# EAGLE design through hole mk1 (EAGLE 6.2)
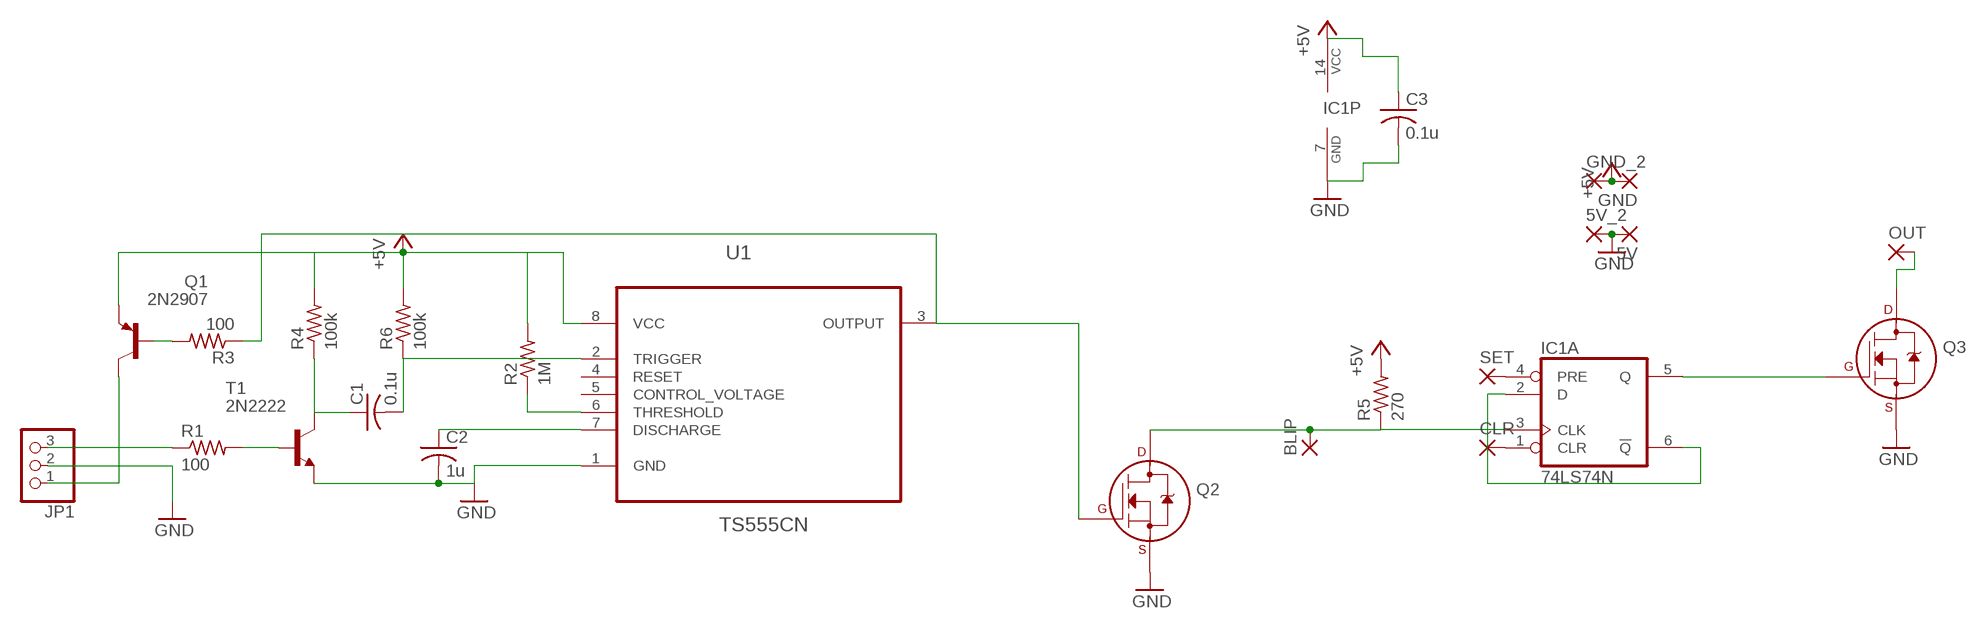
[diagram p0: schematic, sheet 1]

## Parts
5V  1,6/0,8  [1,6/0,8]
5V_2  1,6/0,8  [1,6/0,8]
BLIP  1,6/0,8  [1,6/0,8]
C1  0.1u  C-US025-030X050  [C025-030X050]
C2  1u  C-US025-030X050  [C025-030X050]
C3  0.1u  C-US025-030X050  [C025-030X050]
CLR  1,6/0,8  [1,6/0,8]
GND  1,6/0,8  [1,6/0,8]
GND_2  1,6/0,8  [1,6/0,8]
IC1  74LS74N  [DIL14]
JP1  PINHD-1X3  [1X03]
OUT  1,6/0,8  [1,6/0,8]
Q1  2N2907  [TO92-EBC-OVAL]
Q2  2N7000_TO92  [TO-92]
Q3  2N7000_TO92  [TO-92]
R1  100  R-US_0204/5  [0204/5]
R2  1M  R-US_0204/5  [0204/5]
R3  100  R-US_0204/5  [0204/5]
R4  100k  R-US_0204/5  [0204/5]
R5  270  R-US_0204/5  [0204/5]
R6  100k  R-US_0204/5  [0204/5]
SET  1,6/0,8  [1,6/0,8]
T1  2N2222  [TO92-EBC-OVAL]
U1  TS555CN  [DIP254P762X533-8]

## Nets
+5V: C3.1 GND.1(P) GND_2.1(P) IC1.14(P:VCC) Q1.E R2.2 R4.2 R5.2 R6.2 U1.8(VCC)
GND: 5V.1(P) 5V_2.1(P) C2.2 C3.2 IC1.7(P:GND) JP1.2 Q2.1(S) Q3.1(S) T1.E U1.1(GND)
N$1: Q1.B R3.2
N$2: JP1.1 Q1.C
N$3: R1.2 T1.B
N$4: JP1.3 R1.1
N$5: IC1.4(A:PRE) SET.1(P)
N$6: C1.1 R4.1 T1.C
N$7: C1.2 R6.1 U1.2(TRIGGER)
N$8: CLR.1(P) IC1.1(A:CLR)
N$9: R2.1 U1.6(THRESHOLD)
N$10: Q2.2(G) R3.1 U1.3(OUTPUT)
N$11: BLIP.1(P) IC1.3(A:CLK) Q2.3(D) R5.1
N$12: IC1.2(A:D) IC1.6(A:!Q)
N$13: IC1.5(A:Q) Q3.2(G)
N$14: C2.1 U1.7(DISCHARGE)
N$15: OUT.1(P) Q3.3(D)
Unconnected: IC1.8(B:!Q) IC1.9(B:Q) IC1.10(B:PRE) IC1.11(B:CLK) IC1.12(B:D) IC1.13(B:CLR) U1.4(RESET) U1.5(CONTROL_VOLTAGE)

## Library data of the parts
5V 5V_2 BLIP CLR GND GND_2 OUT SET = wirepad:1,6/0,8: THROUGH-HOLE PAD
C1-C3 = adafruit:C-US: CAPACITOR, American symbol
IC1 = 74xx-us:74*74: Dual D type positive edge triggered FLIP FLOP, preset and clear
JP1 = adafruit:PINHD-1X3: PIN HEADER
Q1 = adafruit:2N2907*: PNP Transistor Big Oval pads
Q2 Q3 = transistors:2N700*: 2N7000, 2N7002, NDS7002A N-channel enhancement mode MOSFET
R1-R6 = resistor:R-US_: RESISTOR, American symbol
T1 = adafruit:2N2222: NPN TRANSISTOR Big oval pads
U1 = ST Microelctronics_By_element14_Batch_1:TS555CN: Low power single CMOS timer; MPN: TS555CN; OC_FARNELL: 1094382; OC_NEWARK: 89K1755; PACKAGE: 8-DIP; SUPPLIER: STMICROELECTRONICS

## Board
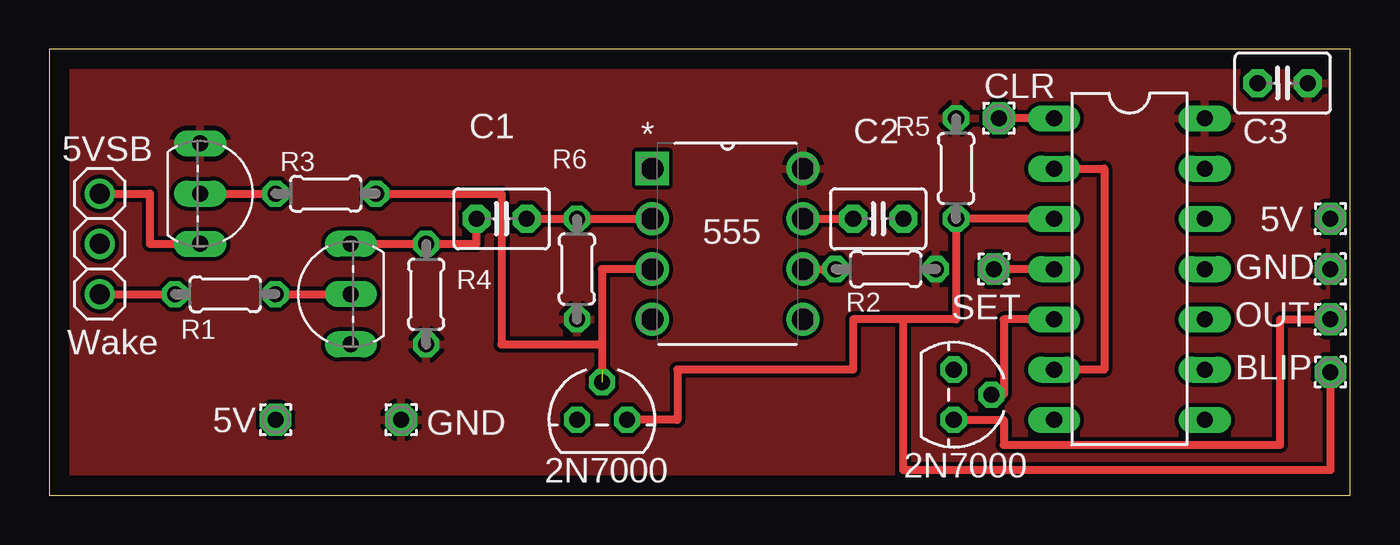
[diagram p1: board, top side]
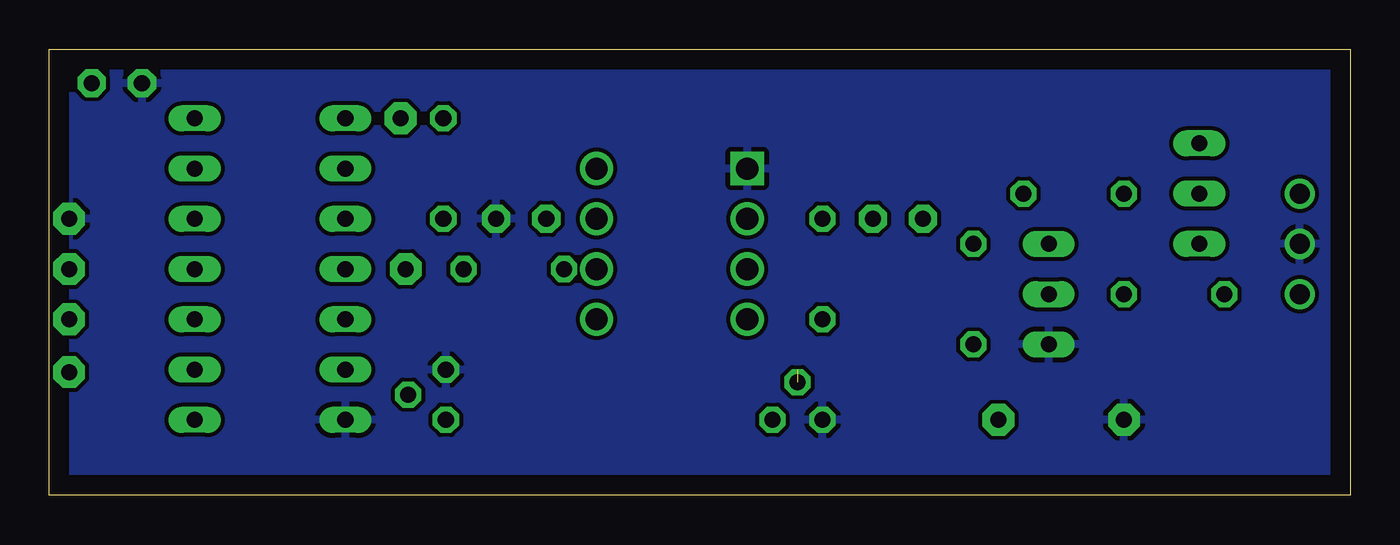
[diagram p2: board, bottom side, seen from below]

Size 65.77 x 22.53 mm. Coordinates in mm from the lower left corner, seen from the top.
Outline: 0,0 65.77,0 65.77,22.53 0,22.53 0,0
Copper layers (1*16): Top 0.035mm / dielectric 1.5mm / Bottom 0.035mm
Design rules: minimum track width 10mil, minimum drill 24mil, track to track 8mil, track to pad 8mil, pad to pad 8mil, via to via 8mil, smd to smd 8mil, copper to edge 40mil, drill to drill 8mil, minimum pad ring 10mil, minimum via ring 8mil, stop-mask expansion 4mil, vias tented up to drill 0mil, thermal gap 10mil

### Footprints (pad centres in the part's own frame; a part is rotated, then mirrored left to right if it is on the bottom)
1,6/0,8 = drill 0.813 pad 1.6 octagon: 1 0,0
C025-030X050 = drill 0.813 pad 1.422 octagon: 1 -1.27,0; 2 1.27,0
DIL14 = drill 0.813 long: 1 -7.62,-3.81; 2 -5.08,-3.81; 3 -2.54,-3.81; 4 0,-3.81; 5 2.54,-3.81; 6 5.08,-3.81; 7 7.62,-3.81; 8 7.62,3.81; 9 5.08,3.81; 10 2.54,3.81; 11 0,3.81; 12 -2.54,3.81; 13 -5.08,3.81; 14 -7.62,3.81
1X03 = drill 1.016: 1 -2.54,0; 2 0,0; 3 2.54,0
TO92-EBC-OVAL = drill 0.813 long: B 0,-1.27; C 2.54,-1.27; E -2.54,-1.27
TO-92 = drill 0.813 octagon: 1 -1.27,0; 2 0,1.905; 3 1.27,0
0204/5 = drill 0.813 octagon: 1 -2.54,0; 2 2.54,0
DIP254P762X533-8 = drill 1.118 square: 1 -7.62,7.62 | drill 1.118: 2 -7.62,5.08; 3 -7.62,2.54; 4 -7.62,0; 5 0,0; 6 0,2.54; 7 0,5.08; 8 0,7.62

### Placement (x,y rotation side)
5V  11.43,3.81 0 top
5V_2  64.77,13.97 0 top
BLIP  64.77,6.22 0 top
C1  22.86,13.97 0 top
C2  41.91,13.97 0 top
C3  62.36,20.83 180 top
CLR  48.01,19.05 0 top
GND  17.78,3.81 0 top
GND_2  64.77,11.43 0 top
IC1  54.61,11.43 270 top
JP1  2.54,12.7 270 top
OUT  64.77,8.89 0 top
Q1  8.89,15.24 270 top
Q2  27.94,3.81 0 top
Q3  45.72,5.08 270 top
R1  8.89,10.16 0 top
R2  42.29,11.43 0 top
R3  13.97,15.24 180 top
R4  19.05,10.16 270 top
R5  45.85,16.51 90 top
R6  26.67,11.43 270 top
SET  47.75,11.43 0 top
T1  13.97,10.16 90 top
U1  38.1,8.89 0 top

### Tracks (layer width: path | path; a pad name or v marks a point on that pad's centre or on a via)
+5V
  pour Top: 0,22.86 0,0 65.79,0 65.79,22.61
GND
  pour Bottom: 0,0 0,22.86 65.79,22.61 65.79,0
N$1
  Top 0.406: Q1.B R3.2
N$2
  Top 0.406: JP1.1 5.08,15.24 5.08,12.7 Q1.C
N$3
  Top 0.406: R1.2 T1.B
N$4
  Top 0.406: JP1.3 R1.1
N$5
  Top 0.406: IC1.4 SET.1
N$6
  Top 0.406: T1.C R4.1 21.59,12.7 C1.1
N$7
  Top 0.406: C1.2 R6.1 U1.2
N$8
  Top 0.406: IC1.1 CLR.1
N$9
  Top 0.406: U1.6 R2.1
N$10  (1 unrouted)
  Top 0.406: U1.3 27.94,11.43 27.94,7.62 | 27.94,7.62 27.94,6.35 | R3.1 22.86,15.24 22.86,7.62 27.94,7.62
N$11
  Top 0.406: IC1.3 R5.1 45.85,8.89 43.18,8.89 | 43.18,8.89 40.64,8.89 40.64,6.35 31.75,6.35 31.75,3.81 Q2.3 | BLIP.1 64.77,1.27 43.18,1.27 43.18,8.89
N$12
  Top 0.406: IC1.2 53.34,16.51 53.34,6.35 IC1.6
N$13
  Top 0.406: IC1.5 48.26,8.89 48.26,5.08 Q3.2
N$14
  Top 0.406: U1.7 C2.1
N$15
  Top 0.406: Q3.3 48.26,3.81 48.26,2.54 62.23,2.54 62.23,8.89 OUT.1

### Text on the board
tNames: 5VSB | 555 | 5V | GND | Wake | 2N7000 | 2N7000